# EAGLE schematic schema auto (EAGLE 9.7.0)
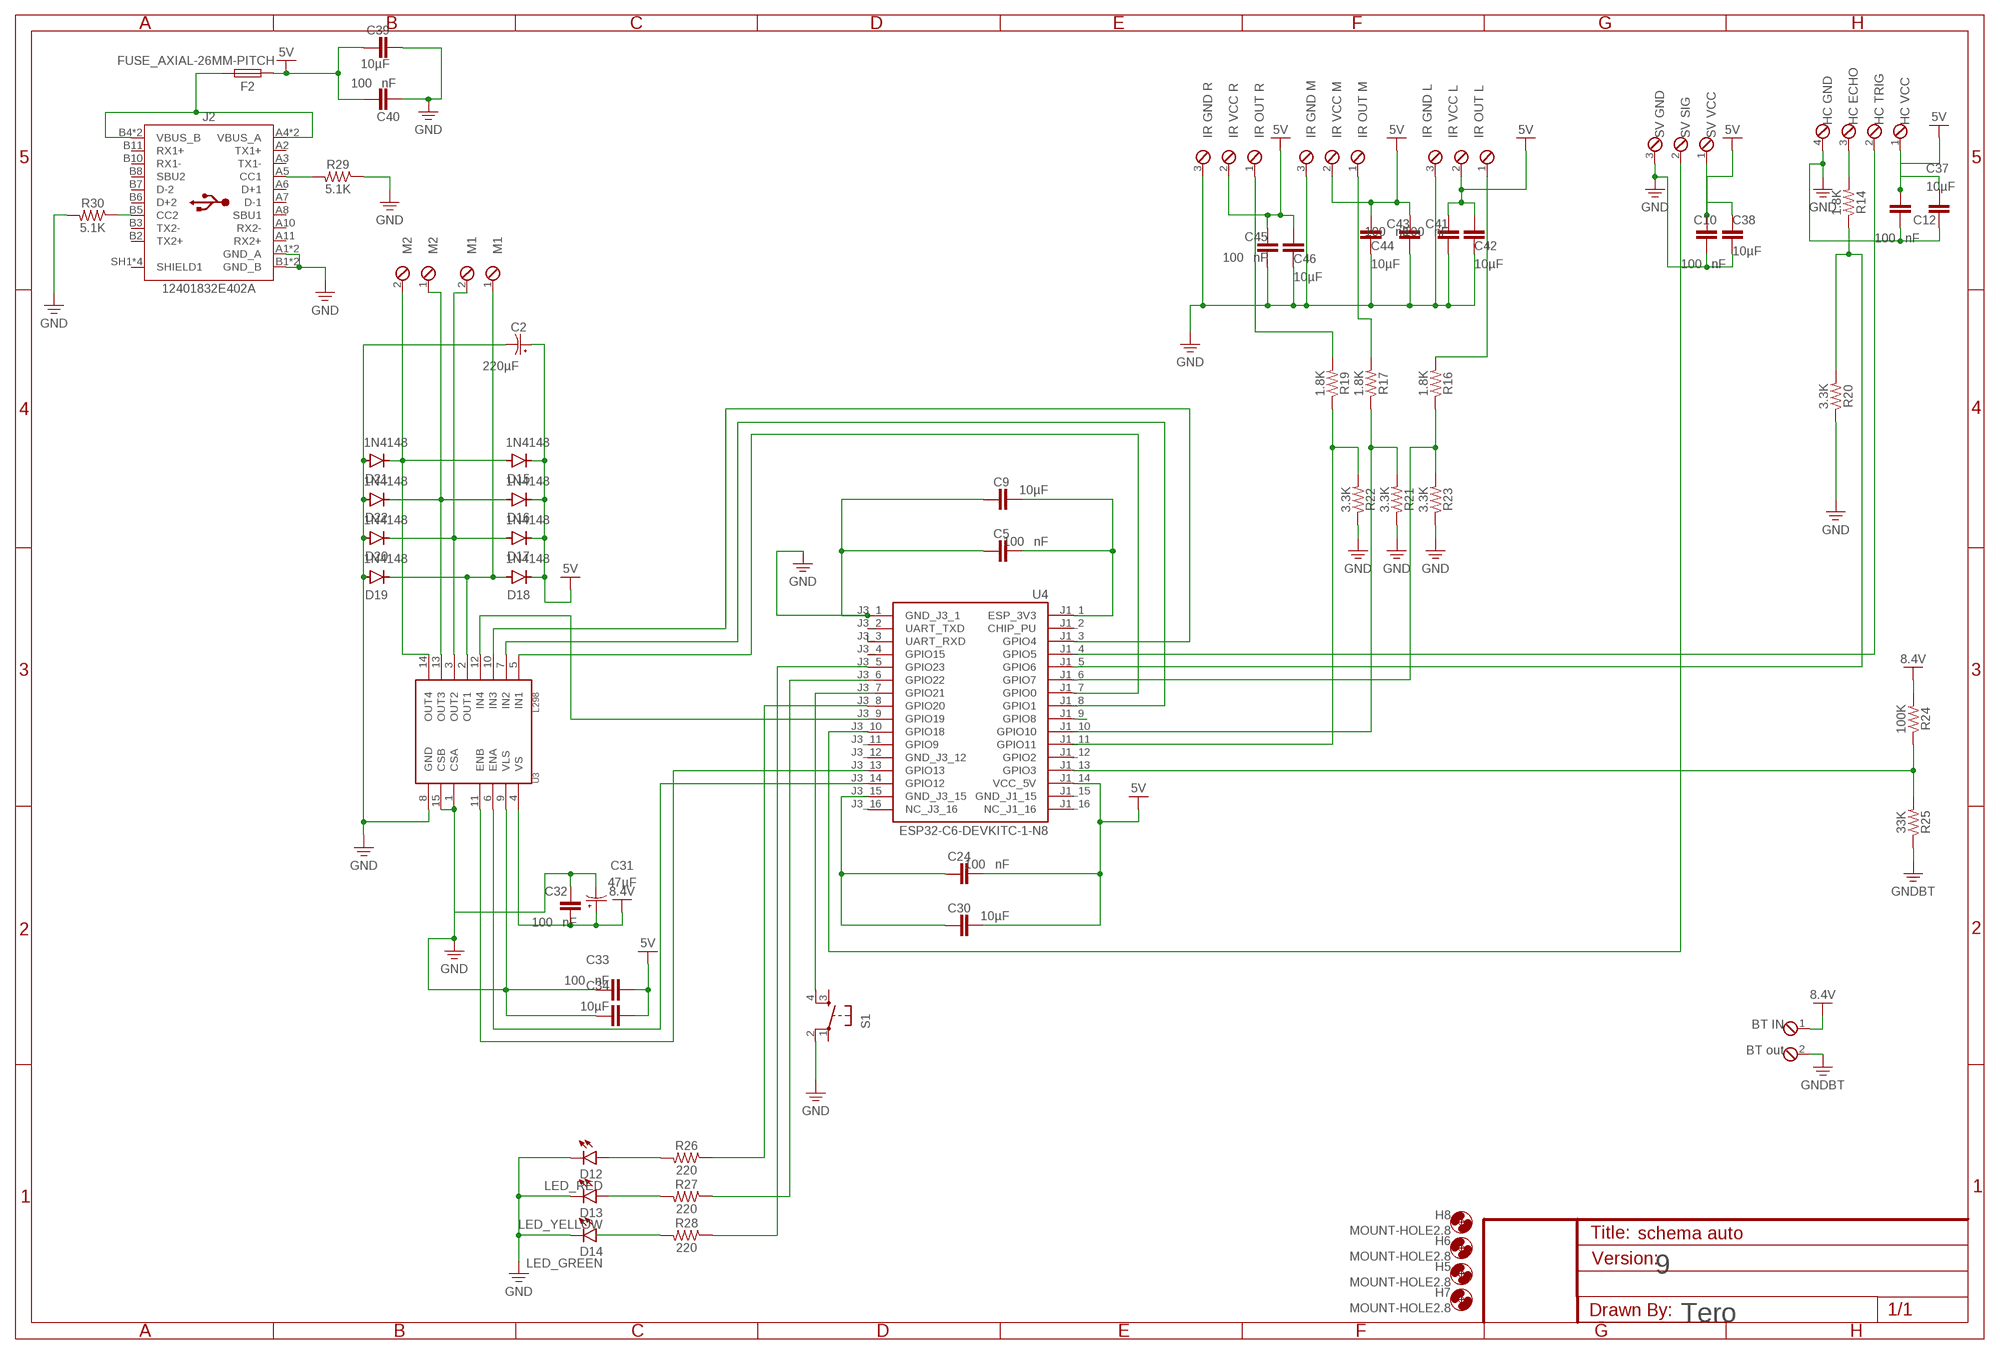
[diagram p0: schematic, sheet 1]

## Parts
C2  C-POL-US_TANTALUM-1206(3216-METRIC)  [CAPMP3216X180N]
C5  100 nF  CAPACITORCERAMIC-2.54MM  [CAP-THRU-2.54MM]
C9  10µF  CAPACITORCERAMIC-2.54MM  [CAP-THRU-2.54MM]
C10  100 nF  CAPACITORCERAMIC-2.54MM  [CAP-THRU-2.54MM]
C12  100 nF  CAPACITORCERAMIC-2.54MM  [CAP-THRU-2.54MM]
C24  100 nF  CAPACITORCERAMIC-2.54MM  [CAP-THRU-2.54MM]
C30  10µF  CAPACITORCERAMIC-2.54MM  [CAP-THRU-2.54MM]
C31  47µF  C-POL-US_TANTALUM-1206(3216-METRIC)  [CAPMP3216X180N]
C32  100 nF  CAPACITORCERAMIC-2.54MM  [CAP-THRU-2.54MM]
C33  100 nF  CAPACITORCERAMIC-2.54MM  [CAP-THRU-2.54MM]
C34  10µF  CAPACITORCERAMIC-2.54MM  [CAP-THRU-2.54MM]
C37  10µF  CAPACITORCERAMIC-2.54MM  [CAP-THRU-2.54MM]
C38  10µF  CAPACITORCERAMIC-2.54MM  [CAP-THRU-2.54MM]
C39  10µF  CAPACITORCERAMIC-2.54MM  [CAP-THRU-2.54MM]
C40  100 nF  CAPACITORCERAMIC-2.54MM  [CAP-THRU-2.54MM]
C41  100 nF  CAPACITORCERAMIC-2.54MM  [CAP-THRU-2.54MM]
C42  10µF  CAPACITORCERAMIC-2.54MM  [CAP-THRU-2.54MM]
C43  100 nF  CAPACITORCERAMIC-2.54MM  [CAP-THRU-2.54MM]
C44  10µF  CAPACITORCERAMIC-2.54MM  [CAP-THRU-2.54MM]
C45  100 nF  CAPACITORCERAMIC-2.54MM  [CAP-THRU-2.54MM]
C46  10µF  CAPACITORCERAMIC-2.54MM  [CAP-THRU-2.54MM]
D12  LED_RED  LED_RADIAL_WHITE  [LEDRD254W60D565H860B_W]
D13  LED_YELLOW  LED_RADIAL_WHITE  [LEDRD254W60D565H860B_W]
D14  LED_GREEN  LED_RADIAL_WHITE  [LEDRD254W60D565H860B_W]
D15  1N4148  1N4004  [DO-41]
D16  1N4148  1N4004  [DO-41]
D17  1N4148  1N4004  [DO-41]
D18  1N4148  1N4004  [DO-41]
D19  1N4148  1N4004  [DO-41]
D20  1N4148  1N4004  [DO-41]
D21  1N4148  1N4004  [DO-41]
D22  1N4148  1N4004  [DO-41]
F2  FUSE_AXIAL-26MM-PITCH  [FUSAD2590W70L2150D550B]
H5  MOUNT-HOLE2.8  [2,8]
H6  MOUNT-HOLE2.8  [2,8]
H7  MOUNT-HOLE2.8  [2,8]
H8  MOUNT-HOLE2.8  [2,8]
J2  12401832E402A  [12401832E402A]
R14  1.8K  RESISTORAXIAL-0.3  [AXIAL-0.3]
R16  1.8K  RESISTORAXIAL-0.3  [AXIAL-0.3]
R17  1.8K  RESISTORAXIAL-0.3  [AXIAL-0.3]
R19  1.8K  RESISTORAXIAL-0.3  [AXIAL-0.3]
R20  3.3K  RESISTORAXIAL-0.3  [AXIAL-0.3]
R21  3.3K  RESISTORAXIAL-0.3  [AXIAL-0.3]
R22  3.3K  RESISTORAXIAL-0.3  [AXIAL-0.3]
R23  3.3K  RESISTORAXIAL-0.3  [AXIAL-0.3]
R24  100K  RESISTORAXIAL-0.3  [AXIAL-0.3]
R25  33K  RESISTORAXIAL-0.3  [AXIAL-0.3]
R26  220  RESISTORAXIAL-0.3  [AXIAL-0.3]
R27  220  RESISTORAXIAL-0.3  [AXIAL-0.3]
R28  220  RESISTORAXIAL-0.3  [AXIAL-0.3]
R29  5.1K  RESISTORAXIAL-0.3  [AXIAL-0.3]
R30  5.1K  RESISTORAXIAL-0.3  [AXIAL-0.3]
S1  TAC_SWITCHPTH  [TACTILE-PTH]
U3  L298  [MULTIWATT15]
U4  ESP32-C6-DEVKITC-1-N8  [MODULE_ESP32-C6-DEVKITC-1-N8]
X2  HC GND  MPT4  [4POL254]
X3  MPT2  [2POL254]
X4  MPT3  [3POL254]
X5  MPT3  [3POL254]
X6  MPT3  [3POL254]
X7  MPT2  [2POL254]
X8  MPT2  [2POL254]
X9  MPT3  [3POL254]

## Nets
5V: C2.1(+) C10.1 C12.1 C24.2 C30.2 C33.2 C34.2 C37.1 C38.1 C39.1 C40.2 C41.2 C42.1 C43.2 C44.1 C45.2 C46.1 D15.C D16.C D17.C D18.C F2.2 U4.J1_14(VCC_5V) X2.1 X4.2 X5.2 X6.2 X9.1
8.4V: C31.1(+) C32.2 R24.P$2 U3.4(VS) X3.1
GND: C2.2(-) C5.1 C9.1 C10.2 C12.2 C31.2(-) C32.1 C33.1 C34.1 C37.2 C38.2 C39.2 C40.1 C41.1 C42.2 C43.1 C44.2 C45.1 C46.2 D12.2(C) D13.2(C) D14.2(C) D19.A D20.A D21.A D22.A J2.A1(GND_A) J2.A12(GND_A) J2.B1(GND_B) J2.B12(GND_B) R20.P$1 R21.P$1 R22.P$1 R23.P$1 R29.P$1 R30.P$2 S1.2 U3.1(CSA) U3.8(GND) U3.9(VLS) U3.15(CSB) U4.J3_1(GND_J3_1) X2.4 X4.3 X5.3 X6.3 X9.3
GNDBT: R25.P$1 X3.2
GPIO-1: U3.12(IN4) U4.J3_9(GPIO19)
GPIO-2: U3.10(IN3) U4.J1_3(GPIO4)
N$22: U3.5(IN1) U4.J1_7(GPIO0)
N$29: U3.7(IN2) U4.J1_8(GPIO1)
N$30: D18.A D19.C U3.2(OUT1) X7.1
N$32: D16.A D22.C U3.13(OUT3) X8.1
N$33: D15.A D21.C U3.14(OUT4) X8.2
N$34: D17.A D20.C U3.3(OUT2) X7.2
N$37: R24.P$1 R25.P$2 U4.J1_13(GPIO3)
N$38: D12.1(A) R26.P$2
N$44: D13.1(A) R27.P$2
N$45: D14.1(A) R28.P$2
N$46: U4.J3_3(UART_RXD)
N$47: R17.P$1 R21.P$2 U4.J1_10(GPIO10)
N$48: R19.P$2 X6.1
N$49: U4.J1_4(GPIO5) X2.2
N$50: U4.J3_10(GPIO18) X9.2
N$51: R14.P$2 X2.3
N$52: R16.P$1 R23.P$2 U4.J1_6(GPIO7)
N$53: R17.P$2 X5.1
N$54: R19.P$1 R22.P$2 U4.J1_11(GPIO11)
N$55: C5.2 C9.2 U4.J1_1(ESP_3V3)
N$56: C24.1 C30.1 U4.J3_15(GND_J3_15)
N$57: R28.P$1 U4.J3_5(GPIO23)
N$58: R27.P$1 U4.J3_6(GPIO22)
N$59: R26.P$1 U4.J3_8(GPIO20)
N$60: S1.4 U4.J3_7(GPIO21)
N$61: U4.J1_9(GPIO8)
N$62: R14.P$1 R20.P$2 U4.J1_5(GPIO6)
N$63: R16.P$2 X4.1
N$64: F2.1 J2.A4(VBUS_A) J2.A9(VBUS_A) J2.B4(VBUS_B) J2.B9(VBUS_B)
N$65: J2.A5(CC1) R29.P$2
N$66: J2.B5(CC2) R30.P$1
N$67: U3.6(ENA) U4.J3_14(GPIO12)
N$68: U3.11(ENB) U4.J3_13(GPIO13)
Unconnected: J2.A2(TX1+) J2.A3(TX1-) J2.A6(D+1) J2.A7(D-1) J2.A8(SBU1) J2.A10(RX2-) J2.A11(RX2+) J2.B2(TX2+) J2.B3(TX2-) J2.B6(D+2) J2.B7(D-2) J2.B8(SBU2) J2.B10(RX1-) J2.B11(RX1+) J2.SH1(SHIELD1) J2.SH2(SHIELD1) J2.SH3(SHIELD1) J2.SH4(SHIELD1) S1.1 S1.3 U4.J1_2(CHIP_PU) U4.J1_12(GPIO2) U4.J1_16(NC_J1_16) U4.J3_2(UART_TXD) U4.J3_4(GPIO15) U4.J3_11(GPIO9) U4.J3_16(NC_J3_16)

## Notes on the sheet
- HC GND | HC ECHO | HC TRIG | HC VCC
- IR GND R | IR VCC R | IR OUT R | IR GND M | IR VCC M | IR OUT M | IR GND L | IR VCC L | IR OUT L | SV GND | SV SIG | SV VCC
- M2 | M2 | M1 | M1
- 220µF
- BT IN
- BT out
- 9
- Tero

## Power pins joined to a net without a drawn wire
GND_J1_15: U4.J1_15(GND_J1_15)
GND_J3_12: U4.J3_12(GND_J3_12)

## Library data of the parts
C2 C31 = Capacitor:C-POL-US: Capacitor Polarised - ANSI
C5 C9 C10 C12 C24 C30 C32-C34 C37-C46 = Tinkercad:CAPACITOR: Capacitor - Generic
D12-D14 = Tinkercad:LED_RADIAL: LED - Generic
D15-D22 = Diodes:1N4004: DIODE GEN PURP 400V 1A DO41 Manufacturer's datasheet <https://www.mccsemi.com/pdf/Products/1N4001-1N4007(DO-41).pdf>
F2 = Circuit-Protection:FUSE: Fuse - Generic
H5-H8 = holes:MOUNT-HOLE: MOUNTING HOLE with drill center marker
J2 = Connector_USB:12401832E402A: USB(3.1) Type-C- RCPT- 24POS- SMD-THT-R/A
R14 R16 R17 R19-R30 = SparkFun-Resistors:RESISTOR: Generic Resistor Package
S1 = SparkFun-Retired:TAC_SWITCH: Momentary Switch Button commonly used for reset or general input. Spark Fun Electronics SKU : COM-00097 SMT- SWCH-08247
U3 = SparkFun-IC-Special-Function:L298: L298 Dual Full Bridge Driver
U4 = ESP32-C6-DEVKITC-1-N8 (1):ESP32-C6-DEVKITC-1-N8: Check availability <https://pricing.snapeda.com/parts/ESP32-C6-DEVKITC-1-N8/Espressif%20Systems/view-part?ref=eda>
X2 = con-phoenix-254:MPT4: PHOENIX CONNECTOR
X3 X7 X8 = con-phoenix-254:MPT2: PHOENIX CONNECTOR
X4-X6 X9 = con-phoenix-254:MPT3: PHOENIX CONNECTOR